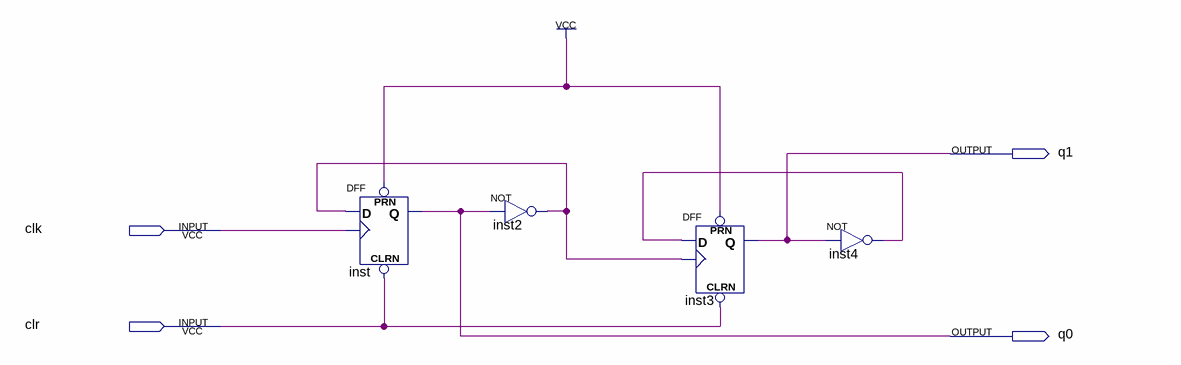
[diagram p0: schematic sheet]
// Quartus schematic CNT.bdf as structural Verilog: 4 symbols, 4 pins
module CNT (
  input  clk,
  input  clr,
  output q1,
  output q0
);

  wire inst2_out, inst4_out;

  DFF inst (.CLRN(clr), .CLK(clk), .D(inst2_out), .PRN(1'b1), .Q(q0));
  not inst2 (inst2_out, q0);
  DFF inst3 (.CLRN(clr), .CLK(inst2_out), .D(inst4_out), .PRN(1'b1), .Q(q1));
  not inst4 (inst4_out, q1);
endmodule
